# EAGLE schematic osi-brain (EAGLE 6.3)
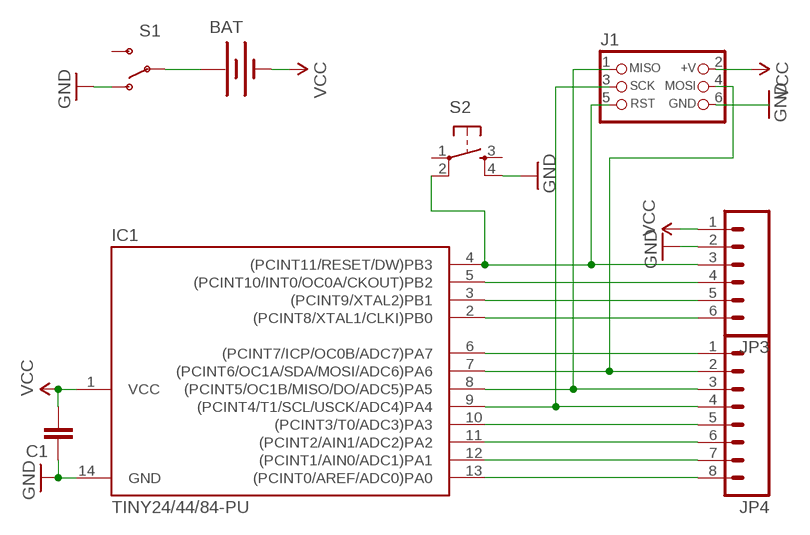
[diagram p0: schematic, sheet 1]

## Parts
BAT  BATTERY20PTH  [BATTCOM_20MM_PTH]
C1  CAPKIT  [CAP-PTH-SMALL-KIT]
IC1  TINY24/44/84-PU  [DIL14]
J1  CON_HEADER_PRG_AVR_ICSP-PTH  [HEADER_PRG_2X03]
JP3  M06SIP  [1X06]
JP4  M081X08  [1X08]
S1  SWITCH-SPSTPTH  [SWITCH-SPDT]
S2  TAC_SWITCHPTH  [TACTILE-PTH]

## Nets
D0: IC1.13((PCINT0/AREF/ADC0)PA0) JP4.8
D1: IC1.12((PCINT1/AIN0/ADC1)PA1) JP4.7
D2: IC1.11((PCINT2/AIN1/ADC2)PA2) JP4.6
D3: IC1.10((PCINT3/T0/ADC3)PA3) JP4.5
D4: IC1.9((PCINT4/T1/SCL/USCK/ADC4)PA4) J1.3(SCK) JP4.4
D5: IC1.8((PCINT5/OC1B/MISO/DO/ADC5)PA5) J1.1(MISO) JP4.3
D6: IC1.7((PCINT6/OC1A/SDA/MOSI/ADC6)PA6) J1.4(MOSI) JP4.2
D7: IC1.6((PCINT7/ICP/OC0B/ADC7)PA7) JP4.1
D8: IC1.5((PCINT10/INT0/OC0A/CKOUT)PB2) JP3.4
D9: IC1.3((PCINT9/XTAL2)PB1) JP3.5
D10: IC1.2((PCINT8/XTAL1/CLKI)PB0) JP3.6
GND: C1.1 IC1.14(GND) JP3.2 S1.1(O) S2.4
N$1: BAT.1(+) S1.2(P)
N$2: J1.6(GND)
RESET: IC1.4((PCINT11/RESET/DW)PB3) J1.5(RST) JP3.3 S2.2
VCC: BAT.2(-) C1.2 IC1.1(VCC) J1.2(+V) JP3.1
Unconnected: S1.3(S) S2.1 S2.3

## Library data of the parts
BAT = SparkFun_mod:BATTERY: Battery Holders Various common sizes : AA, AAA, 20mm coin cell and 12mm coin cell.
C1 = SparkFun:CAP: Capacitor Standard 0603 ceramic capacitor, and 0.1" leaded capacitor.
IC1 = avr-7:TINY24/44/84
J1 = dp_devices:CON_HEADER_PRG_AVR_ICSP: 2x3 AVR ICSP programming header
JP3 = SparkFun_mod:M06: Header 6 Standard 6-pin 0.1" header. Use with straight break away headers (SKU : PRT-00116), right angle break away headers (PRT-00553), swiss pins (PRT-00743), machine pins (PRT-00117), and female headers (PRT-00115). Molex polarized connector foot print use with SKU : PRT-08094 with associated crimp pins and housings. NOTES ON THE VARIANTS LOCK and LOCK_LONGPADS... This footprint was designed to help hold the alignment of a through-hole component (i.e. 6-pin header) while soldering it into place. You may notice that each hole has been shifted either up or down by 0.005 of an inch from it's more standard position (which is a perfectly straight line). This slight alteration caused the pins (the squares in the middle) to touch the edges of the holes. Because they are alternating, it causes a "brace" to hold the component in place. 0.005 has proven to be the perfect amount of "off-center" position when using our standard breakaway headers. Although looks a little odd when you look at the bare footprint, once you have a header in there, the alteration is very hard to notice. Also, if you push a header all the way into place, it is covered up entirely on the bottom side. This idea of altering the position of holes to aid alignment will be further integrated into the Sparkfun Library for other footprints. It can help hold any component with 3 or more connection pins.
JP4 = SparkFun_mod:M08: Header 8 Standard 8-pin 0.1" header. Use with straight break away headers (SKU : PRT-00116), right angle break away headers (PRT-00553), swiss pins (PRT-00743), machine pins (PRT-00117), and female headers (PRT-00115).
S1 = SparkFun:SWITCH-SPST: SPST Switch Simple slide switch. Spark Fun Electronics SKU : COM-00102
S2 = SparkFun:TAC_SWITCH: Momentary Switch Button commonly used for reset or general input. Spark Fun Electronics SKU : COM-00097